# EAGLE design Adafruit QSPI DIP Breakout (EAGLE 9.6.2)
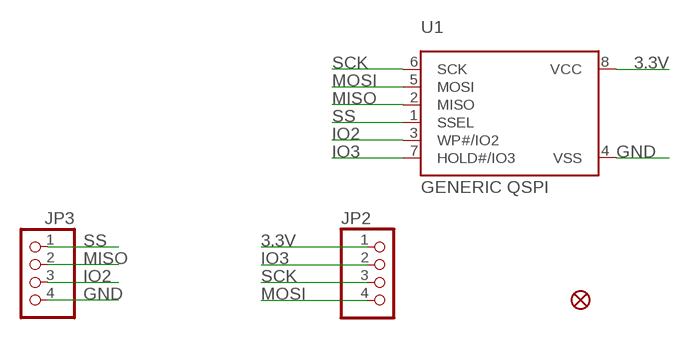
[diagram p0: schematic, sheet 1]

## Parts
FID1  FIDUCIAL_1MM  [FIDUCIAL_1MM]
JP2  HEADER-1X476MIL  [1X04_ROUND_76]
JP3  HEADER-1X476MIL  [1X04_ROUND_76]
U1  GENERIC QSPI  SPIFLASH_8PIN208MIL  [SOIC8_208MIL]

## Nets
3.3V: JP2.1 U1.8(VCC)
GND: JP3.4 U1.4(VSS)
IO2: JP3.3 U1.3(WP#/IO2)
IO3: JP2.2 U1.7(HOLD#/IO3)
MISO: JP3.2 U1.2(MISO)
MOSI: JP2.4 U1.5(MOSI)
SCK: JP2.3 U1.6(SCK)
SS: JP3.1 U1.1(SSEL)

## Library data of the parts
FID1 = microbuilder:FIDUCIAL: Fiducial Alignment Points Various fiducial points for machine vision alignment.; BOM: EXCLUDE
JP2 JP3 = microbuilder:HEADER-1X4: PIN HEADER
U1 = microbuilder:SPIFLASH_8PIN: SOIC8 SPI Flash Be careful with the size since SOIC8 flash comes in several 'widths' SOIC8 150 mil M25P16 - 16Mbit (2Mbit x 8) Serial Flash (75MHz SPI Bus), Supply: 2.7-3.6V Digikey: SOIC8 - M25P16-VMN6P-ND SOIC8 208 mil W25Q16BVSSIG - 16Mbit (2Mbit x 8) Serial Flash (104MHz SPI Bus), Supply: 2.7-3.6V Digikey: SOIC8 - W25Q16BVSSIG-ND

## Board
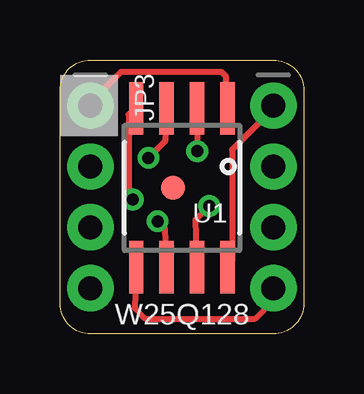
[diagram p1: board, top side]
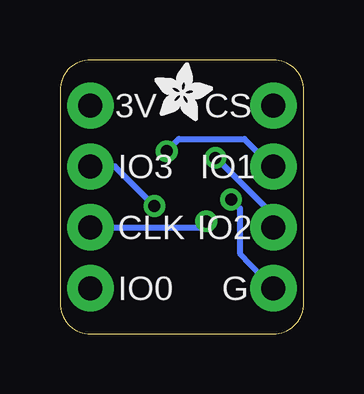
[diagram p2: board, bottom side, seen from below]

Size 10.16 x 11.43 mm. Coordinates in mm from the lower left corner, seen from the top.
Outline: 1.27,11.43 8.89,11.43 arc-90 10.16,10.16 10.16,1.27 arc-90 8.89,0 1.27,0 arc-90 0,1.27 0,10.16 arc-90 1.27,11.43
Copper layers (1*16): Top 0.035mm / dielectric 1.5mm / Bottom 0.035mm
Design rules "adafruit 8-8": minimum track width 6mil, minimum drill 15.5mil, track to track 8mil, track to pad 8mil, pad to pad 8mil, via to via 8mil, smd to smd 8mil, copper to edge 10mil, drill to drill 8mil, minimum pad ring 10mil, minimum via ring 8mil, stop-mask expansion 2mil, vias tented up to drill 20mil, thermal gap 10mil

### Footprints (pad centres in the part's own frame; a part is rotated, then mirrored left to right if it is on the bottom)
FIDUCIAL_1MM = smd 1 x 1: 1 0,0
1X04_ROUND_76 = drill 1 pad 1.93: 1 -3.81,0; 2 -1.27,0; 3 1.27,0; 4 3.81,0
SOIC8_208MIL = smd 0.6 x 2.2: 1 -1.905,-3.315; 2 -0.635,-3.315; 3 0.635,-3.315; 4 1.905,-3.315; 5 1.905,3.315; 6 0.635,3.315; 7 -0.635,3.315; 8 -1.905,3.315

### Placement (x,y rotation side)
FID1  4.7,6.1 0 top
JP2  8.89,5.71 270 top
JP3  1.27,5.71 270 top
U1  5.08,6.1 180 top
U$4  [ADAFRUIT_2.5MM]  6.22,8.89 0 bottom

### Tracks (layer width: path | path; a pad name or v marks a point on that pad's centre or on a via)
3.3V
  Top 0.254: U1.8 7.18,3.04 7.18,7.68 8.83,9.34 JP2.1
GND  (via drill 0.5)
  Top 0.254: U1.4 2.86,9.16 2.86,5.78 v3.03,5.61
  Bottom 0.254: v3.03,5.61 2.67,5.24 2.67,3.37 JP3.4
IO2  (via drill 0.5)
  Top 0.254: U1.3 4.38,8.04 v3.68,7.34
  Bottom 0.254: v3.68,7.34 3.65,7.34 1.21,4.9 JP3.3
IO3  (via drill 0.5)
  Top 0.254: v6.22,5.33 5.65,4.76 U1.7
  Bottom 0.254: v6.22,5.33 7.87,6.99 JP2.2
MISO  (via drill 0.5)
  Top 0.254: U1.2 5.71,9.35 v5.71,7.62
  Bottom 0.254: v5.71,7.62 5.21,8.13 2.48,8.13 1.33,6.99 JP3.2
MOSI
  Top 0.254: U1.5 3.11,1.08 3.56,0.64 8.13,0.64 8.83,1.33 JP2.4
SCK  (via drill 0.5)
  Top 0.254: U1.6 4.38,4.38 v4.06,4.7
  Bottom 0.254: JP2.3 4.32,4.45 v4.06,4.7
SS
  Top 0.254: U1.1 6.92,10.73 6.73,10.92 2.54,10.92 1.21,9.59 JP3.1

### Text on the board
tPlace: W25Q128
bPlace: CS | 3V | IO1 | IO3 | IO2 | CLK | G | IO0